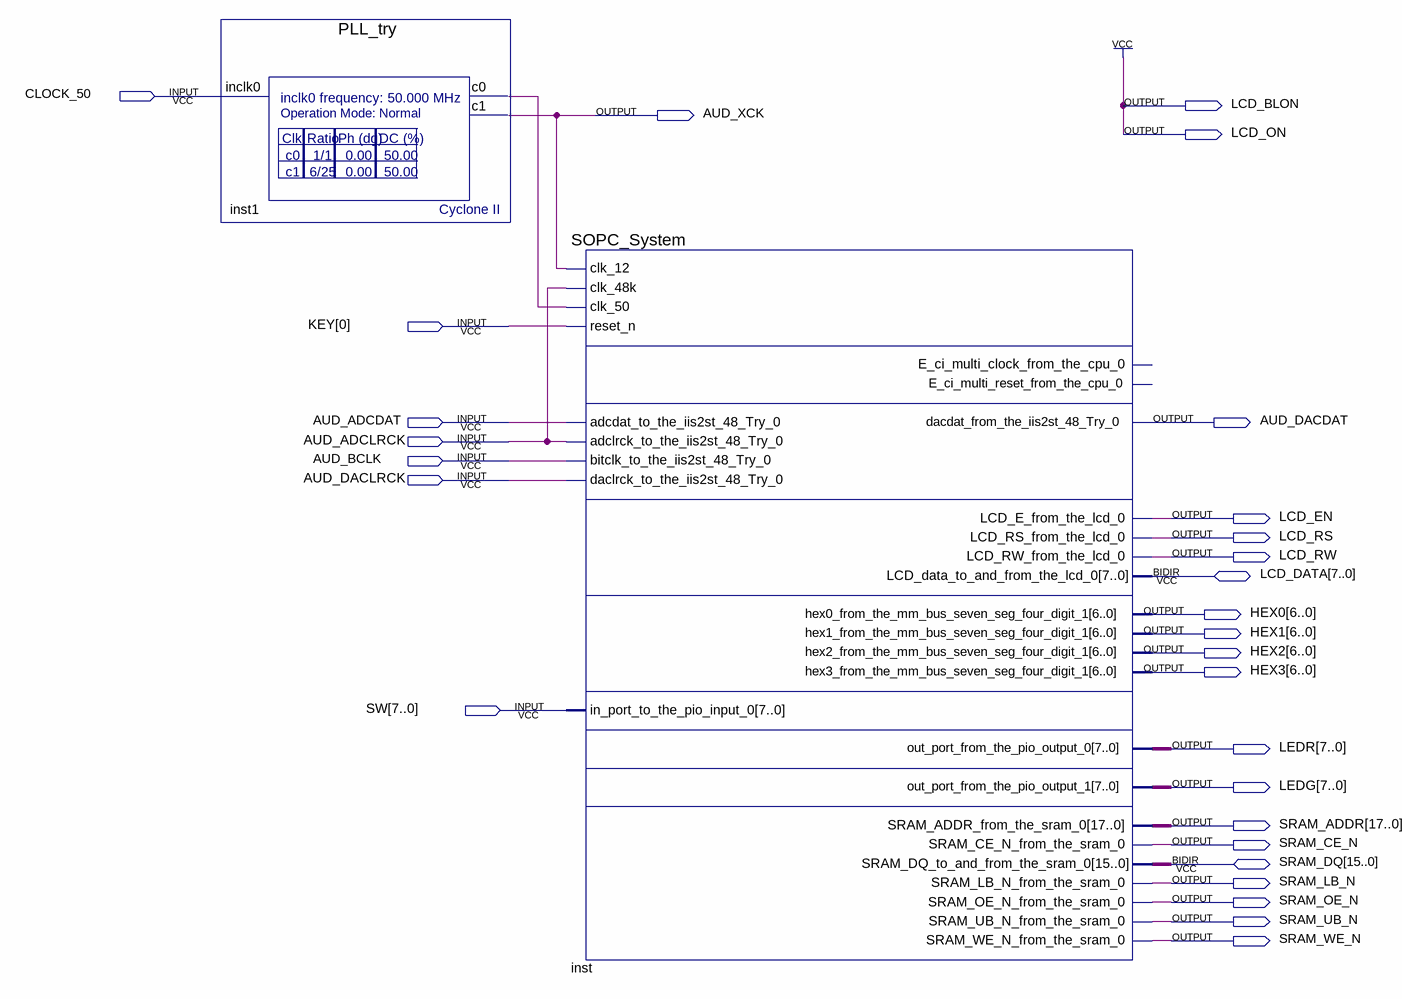
[diagram p0: schematic sheet]
// Quartus schematic firstSopc.bdf as structural Verilog: 2 symbols, 28 pins
module firstSopc (
  input  CLOCK_50,
  input  [0:0] KEY,
  input  AUD_ADCDAT,
  input  AUD_ADCLRCK,
  input  AUD_BCLK,
  input  AUD_DACLRCK,
  input  [7:0] SW,
  inout  [7:0] LCD_DATA,
  inout  [15:0] SRAM_DQ,
  output LCD_BLON,
  output AUD_XCK,
  output LCD_ON,
  output AUD_DACDAT,
  output LCD_EN,
  output LCD_RS,
  output LCD_RW,
  output [6:0] HEX0,
  output [6:0] HEX1,
  output [6:0] HEX2,
  output [6:0] HEX3,
  output [7:0] LEDR,
  output [7:0] LEDG,
  output [17:0] SRAM_ADDR,
  output SRAM_CE_N,
  output SRAM_LB_N,
  output SRAM_OE_N,
  output SRAM_UB_N,
  output SRAM_WE_N
);

  wire inst1_c0;

  PLL_try inst1 (.inclk0(CLOCK_50), .c0(inst1_c0), .c1(AUD_XCK));
  SOPC_System inst (
    .clk_12(AUD_XCK), .clk_48k(AUD_ADCLRCK), .clk_50(inst1_c0), .reset_n(KEY[0]),
    .adcdat_to_the_iis2st_48_Try_0(AUD_ADCDAT), .adclrck_to_the_iis2st_48_Try_0(AUD_ADCLRCK),
    .bitclk_to_the_iis2st_48_Try_0(AUD_BCLK), .daclrck_to_the_iis2st_48_Try_0(AUD_DACLRCK),
    .in_port_to_the_pio_input_0(SW), .dacdat_from_the_iis2st_48_Try_0(AUD_DACDAT),
    .LCD_E_from_the_lcd_0(LCD_EN), .LCD_RS_from_the_lcd_0(LCD_RS), .LCD_RW_from_the_lcd_0(LCD_RW),
    .out_port_from_the_pio_output_0(LEDR), .out_port_from_the_pio_output_1(LEDG),
    .SRAM_ADDR_from_the_sram_0(SRAM_ADDR), .SRAM_CE_N_from_the_sram_0(SRAM_CE_N),
    .SRAM_LB_N_from_the_sram_0(SRAM_LB_N), .SRAM_OE_N_from_the_sram_0(SRAM_OE_N),
    .SRAM_UB_N_from_the_sram_0(SRAM_UB_N), .SRAM_WE_N_from_the_sram_0(SRAM_WE_N),
    .LCD_data_to_and_from_the_lcd_0(LCD_DATA), .SRAM_DQ_to_and_from_the_sram_0(SRAM_DQ));  // open: E_ci_multi_clock_from_the_cpu_0, E_ci_multi_reset_from_the_cpu_0, hex0_from_the_mm_bus_seven_seg_four_digit_1, hex1_from_the_mm_bus_seven_seg_four_digit_1, hex2_from_the_mm_bus_seven_seg_four_digit_1, hex3_from_the_mm_bus_seven_seg_four_digit_1

  assign LCD_BLON = 1'b1;
  assign LCD_ON = 1'b1;
endmodule
